# EAGLE design LPC812_breakout_v2.2 (EAGLE 6.5.0)
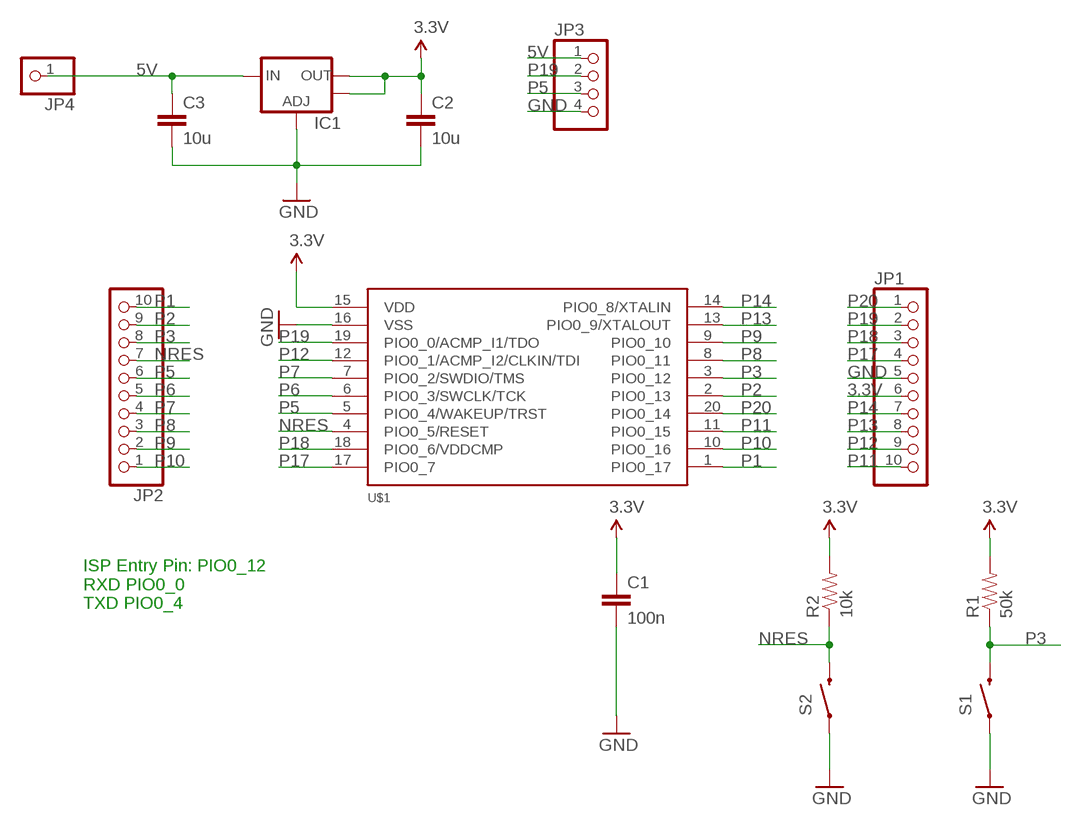
[diagram p0: schematic, sheet 1]

## Parts
C1  100n  CAP0805  [0805]
C2  10u  CAP0805  [0805]
C3  10u  CAP0805  [0805]
IC1  V_REG_LM1117SOT223  [SOT223]
JP1  HEADER-1X10ROUND  [1X10_ROUND]
JP2  HEADER-1X10ROUND  [1X10_ROUND]
JP3  HEADER-1X4ROUND  [1X04_ROUND]
JP4  HEADER-1X1ROUND  [1X01_ROUND]
R1  50k  RESISTOR0805-RES  [0805]
R2  10k  RESISTOR0805-RES  [0805]
S1  SWITCH-MOMENTARY-2-SMD-1101NE  [TACTILE-SWITCH-1101NE]
S2  SWITCH-MOMENTARY-2-SMD-1101NE  [TACTILE-SWITCH-1101NE]
U$1  LPC812M101JDH20  [TSSOP20]

## Nets
3.3V: C1.1 C2.1 IC1.2(OUT) IC1.4(OUT) JP1.6 R1.2 R2.2 U$1.15(VDD)
5V: C3.1 IC1.3(IN) JP3.1 JP4.1
GND: C1.2 C2.2 C3.2 IC1.1(ADJ) JP1.5 JP3.4 S1.P$1 S2.P$1 U$1.16(VSS)
NRES: JP2.7 R2.1 S2.P$2 U$1.4(PIO0_5/RESET)
P1: JP2.10 U$1.1(PIO0_17)
P2: JP2.9 U$1.2(PIO0_13)
P3: JP2.8 R1.1 S1.P$2 U$1.3(PIO0_12)
P5: JP2.6 JP3.3 U$1.5(PIO0_4/WAKEUP/TRST)
P6: JP2.5 U$1.6(PIO0_3/SWCLK/TCK)
P7: JP2.4 U$1.7(PIO0_2/SWDIO/TMS)
P8: JP2.3 U$1.8(PIO0_11)
P9: JP2.2 U$1.9(PIO0_10)
P10: JP2.1 U$1.10(PIO0_16)
P11: JP1.10 U$1.11(PIO0_15)
P12: JP1.9 U$1.12(PIO0_1/ACMP_I2/CLKIN/TDI)
P13: JP1.8 U$1.13(PIO0_9/XTALOUT)
P14: JP1.7 U$1.14(PIO0_8/XTALIN)
P17: JP1.4 U$1.17(PIO0_7)
P18: JP1.3 U$1.18(PIO0_6/VDDCMP)
P19: JP1.2 JP3.2 U$1.19(PIO0_0/ACMP_I1/TDO)
P20: JP1.1 U$1.20(PIO0_14)

## Notes on the sheet
- ISP Entry Pin: PIO0_12
  RXD PIO0_0
  TXD PIO0_4

## Library data of the parts
C1-C3 = SparkFun-Capacitors:CAP: Capacitor Standard 0603 ceramic capacitor, and 0.1" leaded capacitor.
IC1 = SparkFun-PowerIC:V_REG_LM1117: Voltage Regulator LM1117 Standard adjustable voltage regulator but in SMD form. Spark Fun Electronics SKU : COM-00595
JP1 JP2 = microbuilder:HEADER-1X10: PIN HEADER
JP3 = microbuilder:HEADER-1X4: PIN HEADER
JP4 = microbuilder:HEADER-1X1: PIN HEADER
R1 R2 = SparkFun-Resistors:RESISTOR: Resistor Basic schematic elements and footprints for 0603, 1206, and PTH resistors.
S1 S2 = SparkFun-Electromechanical:SWITCH-MOMENTARY-2: Various NO switches- pushbuttons, reed, etc
U$1 = LPC800:LPC812M101JDH20

## Net classes
0 default: width 0.254 mm, clearance 0.203 mm

## Board
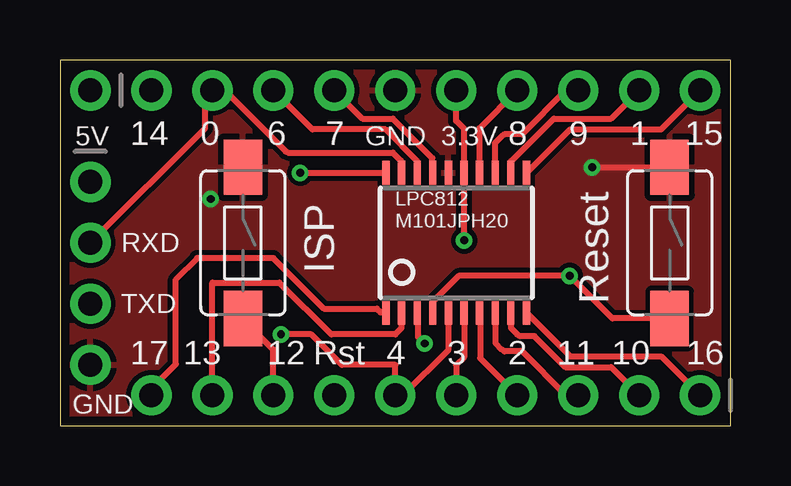
[diagram p1: board, top side]
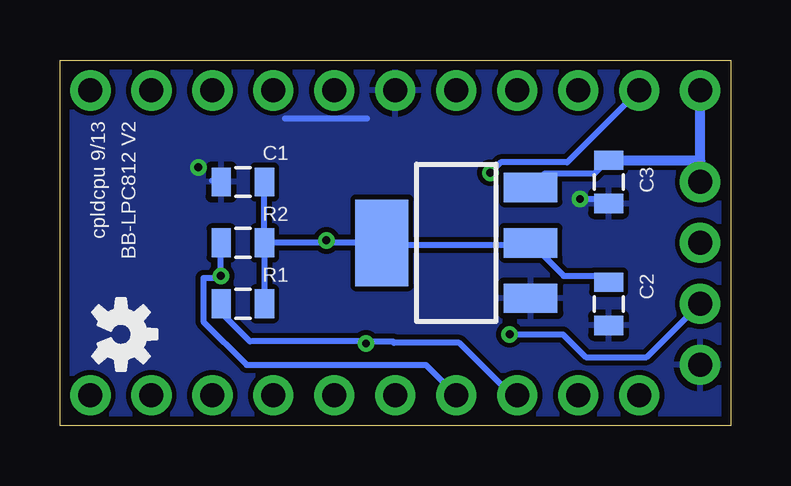
[diagram p2: board, bottom side, seen from below]

Size 27.94 x 15.24 mm. Coordinates in mm from the lower left corner, seen from the top.
Outline: 0,0 27.94,0 27.94,15.24 0,15.24 0,0
Copper layers (1*16): Top 0.0356mm / dielectric 1.5011mm / Bottom 0.0356mm
Design rules "LaenPCBOrder": minimum track width 6mil, minimum drill 13mil, track to track 6mil, track to pad 6mil, pad to pad 6mil, via to via 6mil, smd to smd 6mil, copper to edge 15mil, drill to drill 6mil, minimum pad ring 7mil, minimum via ring 7mil, stop-mask expansion 4mil, vias tented up to drill 0mil, thermal gap 10mil

### Footprints (pad centres in the part's own frame; a part is rotated, then mirrored left to right if it is on the bottom)
0805 = smd 0.8 x 1.2: 1 -0.9,0; 2 0.9,0
SOT223 = smd 1.219 x 2.235: 1 -2.311,-3.099; 2 0,-3.099; 3 2.311,-3.099 | smd 3.6 x 2.2: 4 0,3.099
1X10_ROUND = drill 1 pad 1.676: 1 -11.43,0; 2 -8.89,0; 3 -6.35,0; 4 -3.81,0; 5 -1.27,0; 6 1.27,0; 7 3.81,0; 8 6.35,0; 9 8.89,0; 10 11.43,0
1X04_ROUND = drill 1 pad 1.676: 1 -3.81,0; 2 -1.27,0; 3 1.27,0; 4 3.81,0
1X01_ROUND = drill 1 pad 1.676: 1 0,0
TACTILE-SWITCH-1101NE = smd 2.3 x 1.6: P$1 -3.15,0; P$2 3.15,0
TSSOP20 = smd 0.305 x 0.991: 1 -2.925,-2.918; 2 -2.275,-2.918; 3 -1.625,-2.918; 4 -0.975,-2.918; 5 -0.325,-2.918; 6 0.325,-2.918; 7 0.975,-2.918; 8 1.625,-2.918; 9 2.275,-2.918; 10 2.925,-2.918; 11 2.925,2.918; 12 2.275,2.918; 13 1.625,2.918; 14 0.975,2.918; 15 0.325,2.918; 16 -0.325,2.918; 17 -0.975,2.918; 18 -1.625,2.918; 19 -2.275,2.918; 20 -2.925,2.918

### Placement (x,y rotation side)
C1  20.32,10.16 180 bottom
C2  5.08,5.08 270 bottom
C3  5.08,10.16 270 bottom
IC1  11.43,7.62 90 bottom
JP1  15.24,13.97 0 top
JP2  15.24,1.27 180 top
JP3  1.27,6.35 270 top
JP4  1.27,13.97 0 top
R1  20.32,5.08 0 bottom
R2  20.32,7.62 0 bottom
S1  7.62,7.62 270 top
S2  25.4,7.62 270 top
U$1  16.51,7.62 0 top
U$2  [OSHW-LOGO-S]  25.4,3.81 270 bottom

### Tracks (layer width: path | path; a pad name or v marks a point on that pad's centre or on a via)
3.3V  (via drill 0.33)
  Top 0.254: v16.84,7.72 16.84,10.41 U$1.15 16.84,12.38 16.51,12.7 JP1.6
  Bottom 0.254: C2.1 5.08,5.99 5.33,6.25 6.96,6.25 IC1.2 8.43,7.54 14.43,7.54 IC1.4 16.84,7.62 | R1.2 19.43,5.08 19.43,7.62 R2.2 | C1.1 19.43,10.16 19.43,7.72 R2.2 | 16.84,7.62 R2.2 | v16.84,7.72 16.84,7.62
5V
  Bottom 0.254: IC1.3 7.77,10.49 5.69,10.49 5.18,11 C3.1 5.08,11.11
  Bottom 0.406: C3.1 1.27,11.06 | 1.27,11.06 JP4.1 | 1.27,11.06 JP3.1
GND  (via drill 0.33)
  Top 0.254: v22.17,10.77 S2.P$1 | S2.P$1 | 7.52,10.69 S1.P$1
  Bottom 0.254: C2.2 | 15.14,12.8 18.57,12.8 | 21.21,10.16 C1.2 21.34,10.21 21.61,10.21 | v6.27,9.45 5.31,9.45 5.18,9.32 C3.2
  pour Top: -1.27,16.51 29.21,16.51 29.21,-1.27 -1.27,-1.27
  pour Bottom: -2.54,17.78 30.48,17.78 30.48,-2.54 -2.54,-2.54
NRES  (via drill 0.33)
  Top 0.254: U$1.4 15.54,4.72 15.54,5.18 16.61,6.25 v21.23,6.25 23.01,4.47 S2.P$2
  Bottom 0.254: R2.1 21.23,7.62 v21.23,6.25 21.31,6.15 21.97,6.15 21.97,4.34 20.17,2.54 12.7,2.54 JP2.7
P1
  Top 0.254: JP2.10 3.81,1.55 4.83,2.56 4.83,6.1 5.71,6.99 8.89,6.99 11,4.88 13.21,4.88 13.36,4.72 13.56,4.72 U$1.1
P2
  Top 0.254: JP2.9 6.35,5.97 9.14,5.97 11.3,3.81 13.97,3.81 14.22,4.06 14.22,4.7 U$1.2
P3  (via drill 0.33)
  Top 0.254: JP2.8 8.89,3.17 7.62,4.45 S1.P$2 | v15.19,3.43 14.91,3.71 14.91,4.7 U$1.3
  Bottom 0.254: R1.1 21.21,5.08 21.21,4.62 21.13,4.62 20.02,3.5 19.91,3.53 15.27,3.53 v15.19,3.43 | 15.11,3.5 v15.19,3.43 | JP2.8 9.12,1.27 11.3,3.45 14.02,3.45 14.07,3.5 15.01,3.5 v15.19,3.43
P5  (via drill 0.33)
  Top 0.254: U$1.5 16.19,4.45 16.19,3.17 14.29,1.27 JP2.6 13.97,2.54 11.75,2.54 10.48,3.81 v9.21,3.81
  Bottom 0.254: JP3.3 3.49,2.86 6.03,2.86 6.99,3.81 v9.21,3.81
P6
  Top 0.254: U$1.6 16.84,2.87 16.51,2.54 JP2.5
P7
  Top 0.254: U$1.7 17.5,4.7 17.5,2.82 JP2.4
P8
  Top 0.254: U$1.8 18.14,3.45 18.41,3.17 18.52,3.1 19.25,3.1 21.08,1.27 JP2.3
P9
  Top 0.254: U$1.9 18.79,4.08 19.05,3.81 19.15,3.73 19.76,3.73 21.06,2.44 22.96,2.44 JP2.2
P10
  Top 0.254: U$1.10 19.46,4.7 21.26,2.9 25.04,2.9 JP2.1
P11
  Top 0.254: U$1.11 19.46,10.54 21.26,12.34 25.04,12.34 JP1.10
P12
  Top 0.254: U$1.12 18.8,11.02 20.57,12.8 22.96,12.8 JP1.9
P13
  Top 0.254: U$1.13 18.14,11.79 18.41,12.06 18.52,12.14 19.25,12.14 21.08,13.97 JP1.8
P14
  Top 0.254: U$1.14 17.48,12.4 JP1.7
P17
  Top 0.254: U$1.17 15.52,10.54 15.52,11.15 13.87,12.8 12.6,12.8 JP1.4
P18
  Top 0.254: 9.14,13.72 JP1.3 10.52,12.34 13.56,12.34 14.88,11.02 U$1.18
P19
  Top 0.254: JP1.2 6.86,13.97 9.4,11.43 9.5,11.38 13.87,11.38 14.2,11.05 14.2,10.67 U$1.19 14.22,10.54 | 6.25,13.87 6.25,13.89 JP1.2 | JP3.2 6.03,12.38 6.03,13.65 JP1.2
P20  (via drill 0.33)
  Top 0.254: v10.01,10.54 13.56,10.54 U$1.20
  Bottom 0.254: v10.01,10.54 9.58,10.97 6.81,10.97 JP1.1

### Text on the board
tPlace: 5V | 14 | 0 | 6 | 7 | GND | 3.3V | 8 | 9 | 1 | 15 | LPC812 / M101JPH20 | RXD | ISP | TXD | Reset | 17 | 13 | 12 | Rst | 4 | 3 | 2 | 11 | 10 | 16 | GND
bPlace: BB-LPC812 V2 | cpldcpu 9/13 | C1 | C3 | R2 | R1 | C2